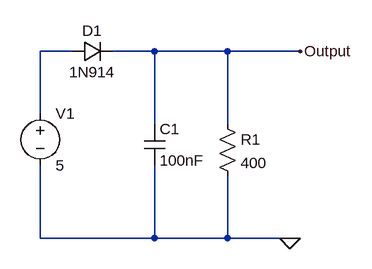
[diagram p0: schematic diode_peak_detector.asc]
diode_peak_detector.asc, the LTspice schematic file:
Version 4
SHEET 1 880 680
WIRE 304 176 256 176
WIRE 432 176 368 176
WIRE 544 176 432 176
WIRE 656 176 544 176
WIRE 256 272 256 176
WIRE 432 288 432 176
WIRE 544 288 544 176
WIRE 256 464 256 352
WIRE 432 464 432 352
WIRE 432 464 256 464
WIRE 544 464 544 368
WIRE 544 464 432 464
WIRE 640 464 544 464
WIRE 656 464 640 464
FLAG 656 176 Output
FLAG 640 464 0
SYMBOL voltage 256 256 R0
SYMATTR InstName V1
SYMATTR Value 5
SYMBOL cap 416 288 R0
SYMATTR InstName C1
SYMATTR Value 100nF
SYMBOL res 528 272 R0
SYMATTR InstName R1
SYMATTR Value 400
SYMBOL diode 304 192 R270
WINDOW 0 32 32 VTop 2
WINDOW 3 0 32 VBottom 2
SYMATTR InstName D1
SYMATTR Value 1N914

The netlist it stands for:
* diode_peak_detector.asc
V1 N001 0 5
C1 Output 0 100nF
R1 Output 0 400
D1 N001 Output 1N914
.model D D
.lib standard.dio
.backanno
.end